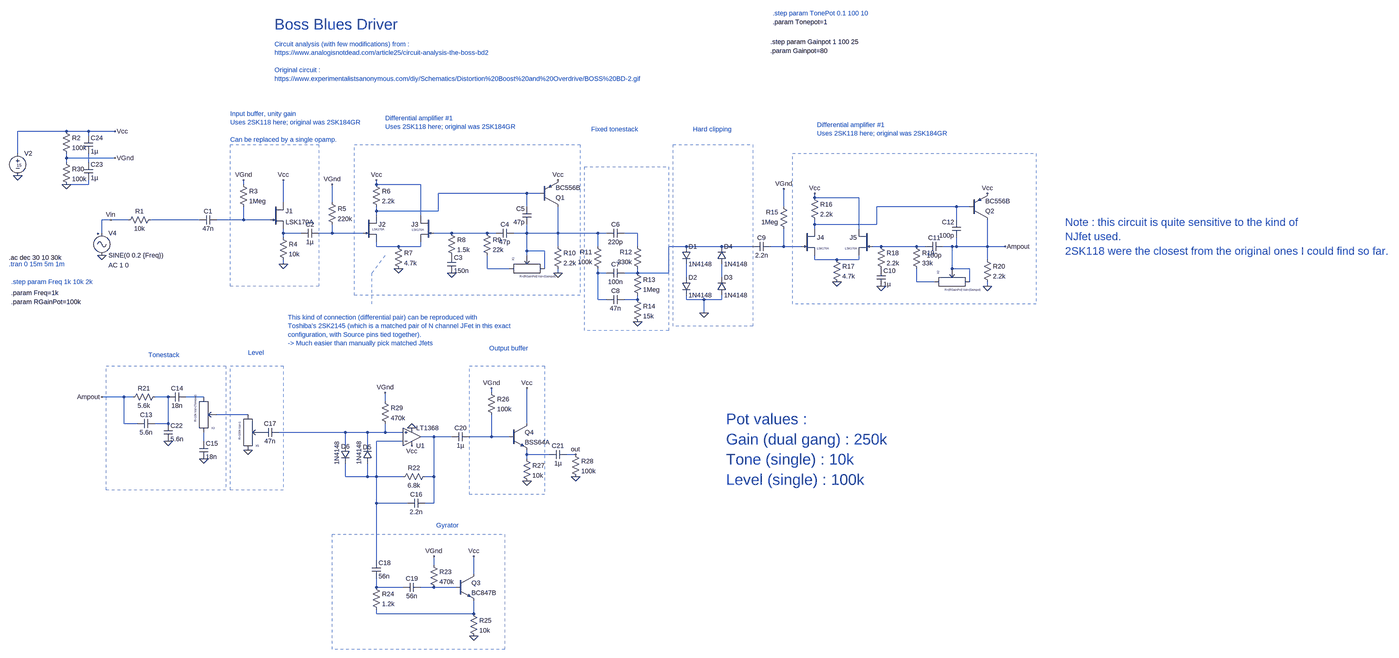
[diagram p0: schematic BossBluesDriver_Tweaked.asc, whole sheet]
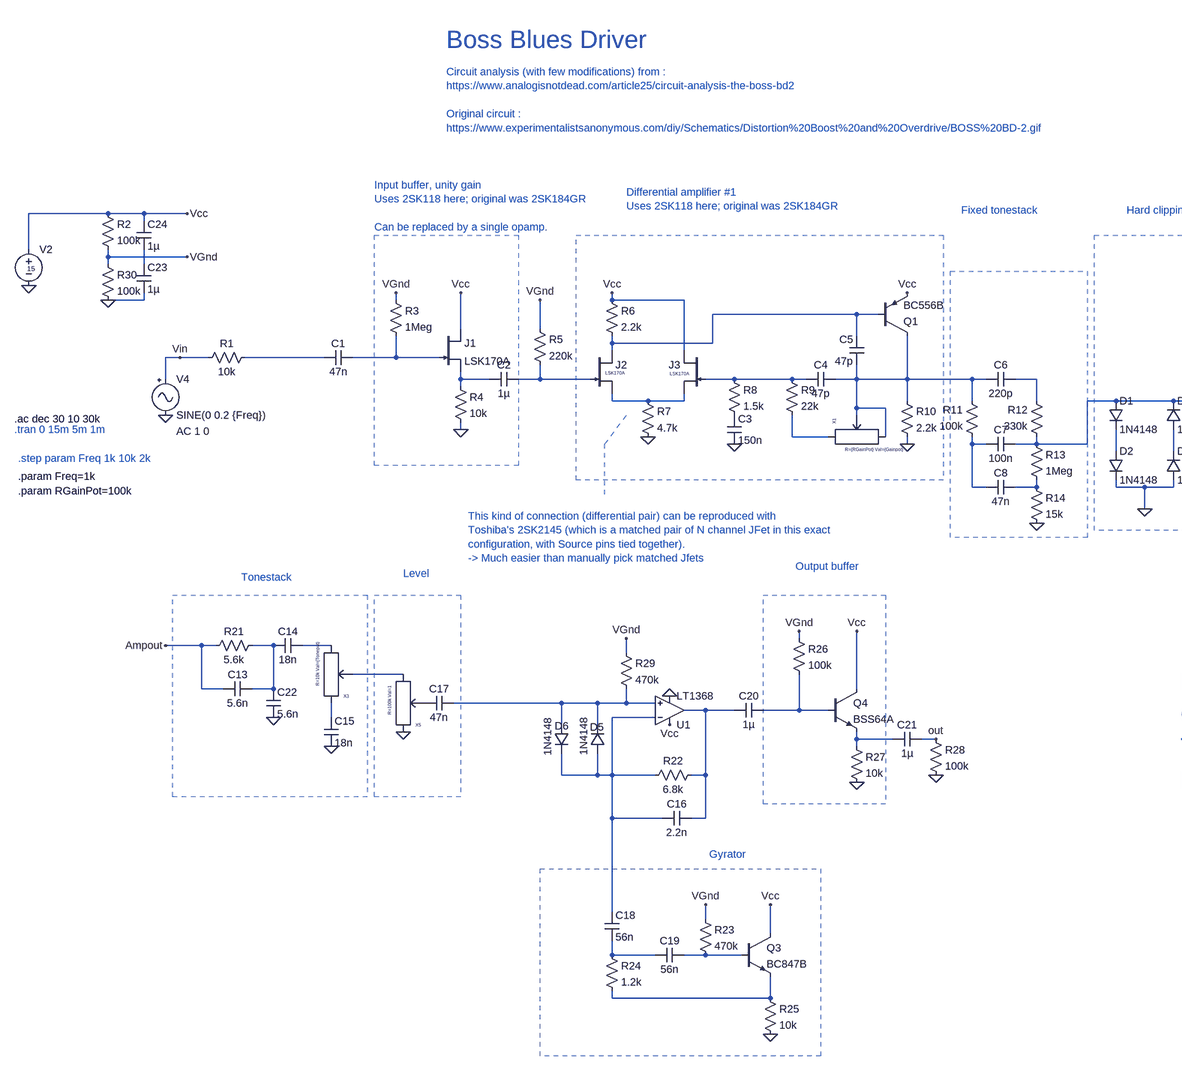
[diagram p1: schematic BossBluesDriver_Tweaked.asc, part, row 1 of 1, column 1 of 2]
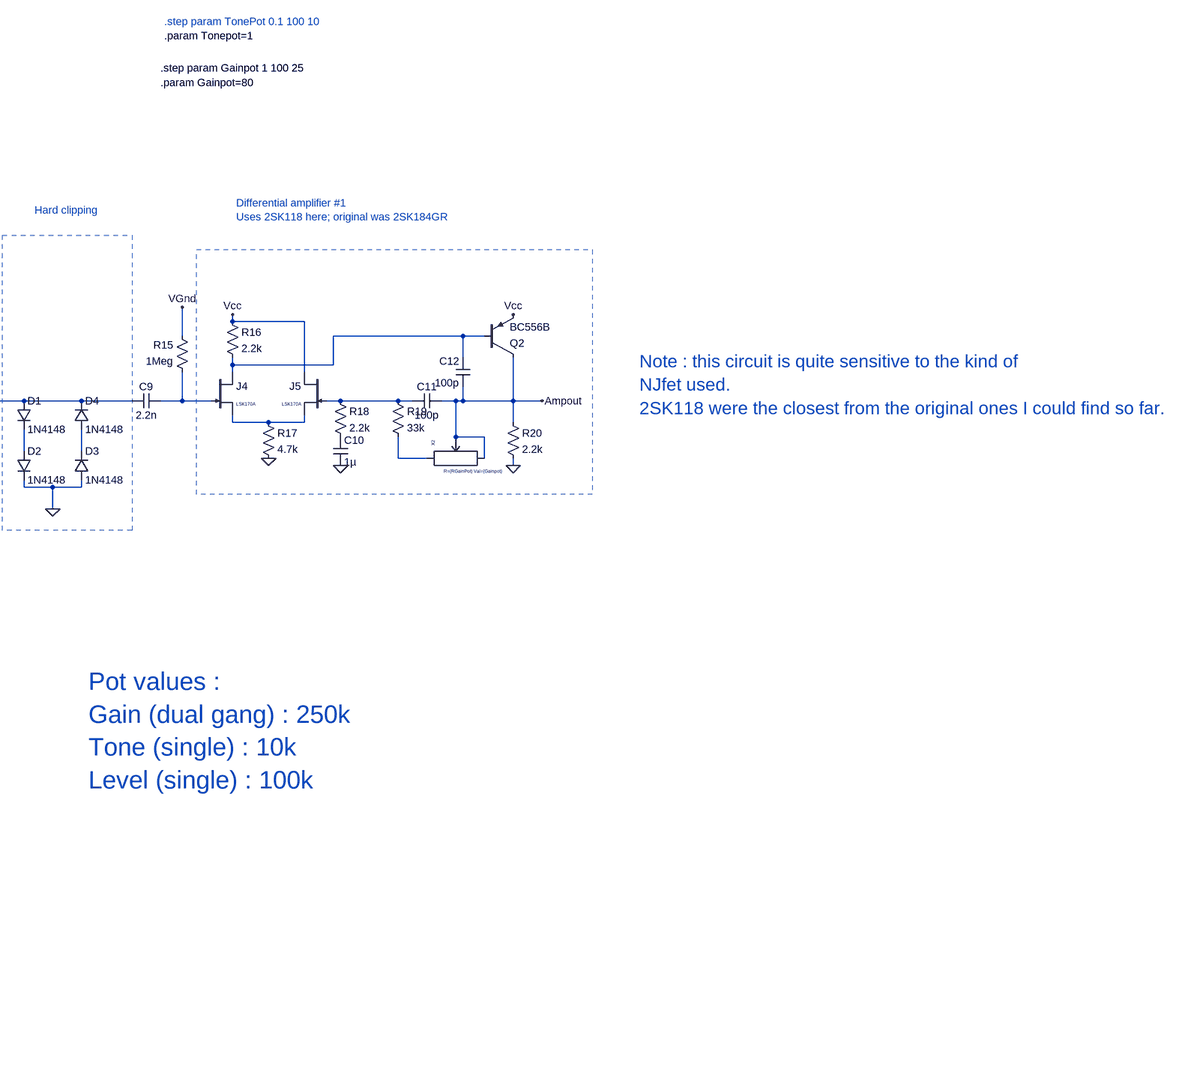
[diagram p2: schematic BossBluesDriver_Tweaked.asc, part, row 1 of 1, column 2 of 2]
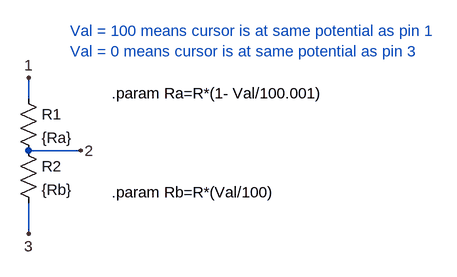
[diagram p3: sub-circuit potentiometer.asc]
BossBluesDriver_Tweaked.asc, the LTspice schematic file:
Version 4
SHEET 1 4768 1732
WIRE -384 -144 -560 -144
WIRE -304 -144 -384 -144
WIRE -208 -144 -304 -144
WIRE -304 -128 -304 -144
WIRE -560 -64 -560 -144
WIRE -384 -48 -384 -64
WIRE -208 -48 -384 -48
WIRE -384 -32 -384 -48
WIRE -304 -32 -304 -64
WIRE -304 48 -304 32
WIRE -304 48 -384 48
WIRE 256 48 256 32
WIRE 736 48 736 32
WIRE 896 48 736 48
WIRE 1280 80 960 80
WIRE 1328 80 1280 80
WIRE 2320 96 2320 80
WIRE 2480 96 2320 96
WIRE 400 112 400 32
WIRE 576 112 576 48
WIRE 1280 128 1280 80
WIRE 2208 128 2208 64
WIRE 2832 128 2544 128
WIRE 2880 128 2832 128
WIRE 736 144 736 128
WIRE 960 144 960 80
WIRE 960 144 736 144
WIRE 736 160 736 144
WIRE 896 160 896 48
WIRE -224 176 -256 176
WIRE -160 176 -224 176
WIRE 96 176 -80 176
WIRE 256 176 256 128
WIRE 256 176 160 176
WIRE 352 176 256 176
WIRE 2832 176 2832 128
WIRE 2320 192 2320 176
WIRE 2544 192 2544 128
WIRE 2544 192 2320 192
WIRE 2320 208 2320 192
WIRE 2480 208 2480 96
WIRE -256 224 -256 176
WIRE 400 224 400 208
WIRE 464 224 400 224
WIRE 576 224 576 192
WIRE 576 224 528 224
WIRE 688 224 576 224
WIRE 1008 224 944 224
WIRE 1136 224 1008 224
WIRE 1168 224 1136 224
WIRE 1280 224 1280 192
WIRE 1280 224 1232 224
WIRE 1392 224 1392 128
WIRE 1392 224 1280 224
WIRE 1536 224 1392 224
WIRE 1568 224 1536 224
WIRE 1680 224 1632 224
WIRE 400 240 400 224
WIRE 736 272 736 256
WIRE 816 272 736 272
WIRE 896 272 896 256
WIRE 896 272 816 272
WIRE 1392 272 1392 224
WIRE 1536 272 1536 224
WIRE 1680 272 1680 224
WIRE 1856 272 1792 272
WIRE 1984 272 1856 272
WIRE 2096 272 1984 272
WIRE 2208 272 2208 208
WIRE 2208 272 2160 272
WIRE 2272 272 2208 272
WIRE 2560 272 2528 272
WIRE 2688 272 2560 272
WIRE 2720 272 2688 272
WIRE 2816 272 2784 272
WIRE 2832 272 2832 240
WIRE 2832 272 2816 272
WIRE 2944 272 2944 176
WIRE 2944 272 2832 272
WIRE 3008 272 2944 272
WIRE 1280 288 1280 224
WIRE 1344 288 1280 288
WIRE 1280 304 1280 288
WIRE 2320 320 2320 304
WIRE 2400 320 2320 320
WIRE 2480 320 2480 304
WIRE 2480 320 2400 320
WIRE 2944 320 2944 272
WIRE 400 336 400 320
WIRE 1136 352 1136 304
WIRE 1216 352 1136 352
WIRE 1344 352 1344 288
WIRE 2816 352 2816 272
WIRE 2880 352 2816 352
WIRE 1392 368 1392 352
WIRE 1536 368 1536 352
WIRE 1568 368 1536 368
WIRE 1680 368 1680 352
WIRE 1680 368 1632 368
WIRE 1792 368 1792 272
WIRE 1792 368 1680 368
WIRE 1856 384 1856 336
WIRE 1984 384 1984 336
WIRE 2688 400 2688 352
WIRE 2752 400 2688 400
WIRE 2880 400 2880 352
WIRE 2944 416 2944 400
WIRE 1536 464 1536 368
WIRE 1568 464 1536 464
WIRE 1680 464 1680 448
WIRE 1680 464 1632 464
WIRE 1856 464 1856 448
WIRE 1920 464 1856 464
WIRE 1984 464 1984 448
WIRE 1984 464 1920 464
WIRE 1920 512 1920 464
WIRE 1152 800 1152 784
WIRE -176 816 -256 816
WIRE -144 816 -176 816
WIRE -16 816 -64 816
WIRE 112 816 48 816
WIRE 768 832 768 800
WIRE 272 880 160 880
WIRE -176 912 -176 816
WIRE -128 912 -176 912
WIRE -16 912 -16 816
WIRE -16 912 -64 912
WIRE 1280 912 1280 784
WIRE 624 944 384 944
WIRE 704 944 624 944
WIRE 768 944 768 912
WIRE 768 944 704 944
WIRE 832 944 768 944
WIRE 944 960 896 960
WIRE 1008 960 944 960
WIRE 1152 960 1152 880
WIRE 1152 960 1072 960
WIRE 1216 960 1152 960
WIRE 112 976 112 944
WIRE 832 976 736 976
WIRE 624 992 624 944
WIRE 704 992 704 944
WIRE 1280 1024 1280 1008
WIRE 1360 1024 1280 1024
WIRE 1456 1024 1424 1024
WIRE 1280 1040 1280 1024
WIRE 624 1104 624 1056
WIRE 704 1104 704 1056
WIRE 704 1104 624 1104
WIRE 736 1104 736 976
WIRE 736 1104 704 1104
WIRE 832 1104 736 1104
WIRE 944 1104 944 960
WIRE 944 1104 912 1104
WIRE 736 1200 736 1104
WIRE 848 1200 736 1200
WIRE 944 1200 944 1104
WIRE 944 1200 912 1200
WIRE 736 1408 736 1200
WIRE 944 1424 944 1392
WIRE 1088 1456 1088 1392
WIRE 736 1504 736 1472
WIRE 832 1504 736 1504
WIRE 944 1504 896 1504
WIRE 1024 1504 944 1504
WIRE 736 1600 736 1584
WIRE 1088 1600 1088 1552
WIRE 1088 1600 736 1600
FLAG -560 16 0
FLAG -208 -48 VGnd
FLAG -208 -144 Vcc
FLAG -256 304 0
FLAG -224 176 Vin
FLAG 400 336 0
FLAG 816 352 0
FLAG 1008 368 0
FLAG 1392 368 0
FLAG 1680 544 0
FLAG 1920 512 0
FLAG 2400 400 0
FLAG 2560 416 0
FLAG 2944 416 0
FLAG 3008 272 Ampout
FLAG -256 816 Ampout
FLAG 112 1040 0
FLAG 272 1008 0
FLAG 1088 1680 0
FLAG 864 928 0
FLAG 864 992 Vcc
FLAG 1280 1120 0
FLAG 1280 784 Vcc
FLAG 1456 1104 0
FLAG -16 976 0
FLAG 1456 1024 out
FLAG -384 48 0
FLAG 256 32 VGnd
FLAG 576 48 VGnd
FLAG 400 32 Vcc
FLAG 736 32 Vcc
FLAG 1392 32 Vcc
FLAG 2208 64 VGnd
FLAG 2320 80 Vcc
FLAG 2944 80 Vcc
FLAG 768 800 VGnd
FLAG 1152 784 VGnd
FLAG 944 1392 VGnd
FLAG 1088 1392 Vcc
SYMBOL voltage -560 -80 R0
WINDOW 123 0 0 Left 0
WINDOW 39 0 0 Left 0
WINDOW 3 -4 58 Left 1
SYMATTR Value 15
SYMATTR InstName V2
SYMBOL Misc\\signal -256 208 R0
WINDOW 123 24 132 Left 2
WINDOW 39 0 0 Left 0
SYMATTR Value2 AC 1 0
SYMATTR InstName V4
SYMATTR Value SINE(0 0.2 {Freq})
SYMBOL cap 160 160 R90
WINDOW 0 0 32 VBottom 2
WINDOW 3 32 32 VTop 2
SYMATTR InstName C1
SYMATTR Value 47n
SYMBOL res 240 32 R0
SYMATTR InstName R3
SYMATTR Value 1Meg
SYMBOL res 384 224 R0
SYMATTR InstName R4
SYMATTR Value 10k
SYMBOL cap 528 208 R90
WINDOW 0 0 32 VBottom 2
WINDOW 3 32 32 VTop 2
SYMATTR InstName C2
SYMATTR Value 1µ
SYMBOL res 560 96 R0
SYMATTR InstName R5
SYMATTR Value 220k
SYMBOL njf 688 160 R0
WINDOW 3 33 51 Left 0
SYMATTR Value LSK170A
SYMATTR InstName J2
SYMBOL res 720 32 R0
SYMATTR InstName R6
SYMATTR Value 2.2k
SYMBOL res 800 256 R0
SYMATTR InstName R7
SYMATTR Value 4.7k
SYMBOL njf 944 160 M0
WINDOW 3 37 52 Left 0
SYMATTR Value LSK170A
SYMATTR InstName J3
SYMBOL res 992 208 R0
SYMATTR InstName R8
SYMATTR Value 1.5k
SYMBOL cap 992 304 R0
SYMATTR InstName C3
SYMATTR Value 150n
SYMBOL res 1120 208 R0
SYMATTR InstName R9
SYMATTR Value 22k
SYMBOL Potentiometer 1280 352 R270
WINDOW 39 -29 -26 VRight 0
SYMATTR SpiceLine R={RGainPot} Val={Gainpot}
SYMATTR InstName X1
SYMBOL cap 1232 208 R90
WINDOW 0 0 32 VBottom 2
WINDOW 3 32 32 VTop 2
SYMATTR InstName C4
SYMATTR Value 47p
SYMBOL cap 1296 192 R180
WINDOW 0 24 56 Left 2
WINDOW 3 24 8 Left 2
SYMATTR InstName C5
SYMATTR Value 47p
SYMBOL pnp 1328 128 M180
SYMATTR InstName Q1
SYMATTR Value BC556B
SYMBOL res 1376 256 R0
SYMATTR InstName R10
SYMATTR Value 2.2k
SYMBOL cap 1632 208 R90
WINDOW 0 0 32 VBottom 2
WINDOW 3 32 32 VTop 2
SYMATTR InstName C6
SYMATTR Value 220p
SYMBOL res 1552 368 R180
WINDOW 0 36 76 Left 2
WINDOW 3 36 40 Left 2
SYMATTR InstName R11
SYMATTR Value 100k
SYMBOL res 1696 368 R180
WINDOW 0 36 76 Left 2
WINDOW 3 36 40 Left 2
SYMATTR InstName R12
SYMATTR Value 330k
SYMBOL cap 1632 352 R90
WINDOW 0 0 32 VBottom 2
WINDOW 3 32 32 VTop 2
SYMATTR InstName C7
SYMATTR Value 100n
SYMBOL cap 1632 448 R90
WINDOW 0 0 32 VBottom 2
WINDOW 3 32 32 VTop 2
SYMATTR InstName C8
SYMATTR Value 47n
SYMBOL res 1664 352 R0
SYMATTR InstName R13
SYMATTR Value 1Meg
SYMBOL res 1664 448 R0
SYMATTR InstName R14
SYMATTR Value 15k
SYMBOL diode 1840 272 R0
SYMATTR InstName D1
SYMATTR Value 1N4148
SYMBOL diode 1840 384 R0
SYMATTR InstName D2
SYMATTR Value 1N4148
SYMBOL diode 1968 448 M180
WINDOW 0 24 64 Left 2
WINDOW 3 24 0 Left 2
SYMATTR InstName D3
SYMATTR Value 1N4148
SYMBOL diode 1968 336 M180
WINDOW 0 24 64 Left 2
WINDOW 3 24 0 Left 2
SYMATTR InstName D4
SYMATTR Value 1N4148
SYMBOL cap 2160 256 R90
WINDOW 0 0 32 VBottom 2
WINDOW 3 32 32 VTop 2
SYMATTR InstName C9
SYMATTR Value 2.2n
SYMBOL res 2224 224 R180
WINDOW 0 36 76 Left 2
WINDOW 3 36 40 Left 2
SYMATTR InstName R15
SYMATTR Value 1Meg
SYMBOL njf 2272 208 R0
WINDOW 3 56 72 Left 0
SYMATTR Value LSK170A
SYMATTR InstName J4
SYMBOL res 2304 80 R0
SYMATTR InstName R16
SYMATTR Value 2.2k
SYMBOL res 2384 304 R0
SYMATTR InstName R17
SYMATTR Value 4.7k
SYMBOL njf 2528 208 M0
WINDOW 3 56 72 Left 0
SYMATTR Value LSK170A
SYMATTR InstName J5
SYMBOL res 2544 256 R0
SYMATTR InstName R18
SYMATTR Value 2.2k
SYMBOL cap 2544 352 R0
SYMATTR InstName C10
SYMATTR Value 1µ
SYMBOL res 2672 256 R0
SYMATTR InstName R19
SYMATTR Value 33k
SYMBOL Potentiometer 2816 400 R270
WINDOW 39 -29 -26 VRight 0
SYMATTR SpiceLine R={RGainPot} Val={Gainpot}
SYMATTR InstName X2
SYMBOL cap 2784 256 R90
WINDOW 0 0 32 VBottom 2
WINDOW 3 32 32 VTop 2
SYMATTR InstName C11
SYMATTR Value 100p
SYMBOL cap 2848 240 R180
WINDOW 0 24 56 Left 2
WINDOW 3 24 8 Left 2
SYMATTR InstName C12
SYMATTR Value 100p
SYMBOL pnp 2880 176 M180
SYMATTR InstName Q2
SYMATTR Value BC556B
SYMBOL res 2928 304 R0
SYMATTR InstName R20
SYMATTR Value 2.2k
SYMBOL res -48 800 R90
WINDOW 0 0 56 VBottom 2
WINDOW 3 32 56 VTop 2
SYMATTR InstName R21
SYMATTR Value 5.6k
SYMBOL cap -64 896 R90
WINDOW 0 0 32 VBottom 2
WINDOW 3 32 32 VTop 2
SYMATTR InstName C13
SYMATTR Value 5.6n
SYMBOL cap 48 800 R90
WINDOW 0 0 32 VBottom 2
WINDOW 3 32 32 VTop 2
SYMATTR InstName C14
SYMATTR Value 18n
SYMBOL Potentiometer 112 880 M180
WINDOW 39 -29 -26 VRight 0
SYMATTR SpiceLine R=10k Val={Tonepot}
SYMATTR InstName X3
SYMBOL cap 96 976 R0
SYMATTR InstName C15
SYMATTR Value 18n
SYMBOL Potentiometer 272 944 M180
WINDOW 39 -29 -26 VRight 0
SYMATTR SpiceLine R=100k Val=1
SYMATTR InstName X5
SYMBOL cap 384 928 R90
WINDOW 0 0 32 VBottom 2
WINDOW 3 32 32 VTop 2
SYMATTR InstName C17
SYMATTR Value 47n
SYMBOL diode 720 1056 R180
WINDOW 0 2 59 Left 2
WINDOW 3 126 -5 VRight 2
SYMATTR InstName D5
SYMATTR Value 1N4148
SYMBOL diode 608 992 R0
WINDOW 0 1 3 Left 2
WINDOW 3 66 68 VLeft 2
SYMATTR InstName D6
SYMATTR Value 1N4148
SYMBOL res 928 1088 R90
WINDOW 0 0 56 VBottom 2
WINDOW 3 32 56 VTop 2
SYMATTR InstName R22
SYMATTR Value 6.8k
SYMBOL cap 912 1184 R90
WINDOW 0 0 32 VBottom 2
WINDOW 3 32 32 VTop 2
SYMATTR InstName C16
SYMATTR Value 2.2n
SYMBOL cap 720 1408 R0
SYMATTR InstName C18
SYMATTR Value 56n
SYMBOL cap 896 1488 R90
WINDOW 0 0 32 VBottom 2
WINDOW 3 32 32 VTop 2
SYMATTR InstName C19
SYMATTR Value 56n
SYMBOL res 928 1408 R0
SYMATTR InstName R23
SYMATTR Value 470k
SYMBOL npn 1024 1456 R0
SYMATTR InstName Q3
SYMATTR Value BC847B
SYMBOL res 720 1488 R0
SYMATTR InstName R24
SYMATTR Value 1.2k
SYMBOL res 1072 1584 R0
SYMATTR InstName R25
SYMATTR Value 10k
SYMBOL cap 1072 944 R90
WINDOW 0 0 32 VBottom 2
WINDOW 3 32 32 VTop 2
SYMATTR InstName C20
SYMATTR Value 1µ
SYMBOL res 1136 784 R0
SYMATTR InstName R26
SYMATTR Value 100k
SYMBOL npn 1216 912 R0
SYMATTR InstName Q4
SYMATTR Value BSS64A
SYMBOL res 1264 1024 R0
SYMATTR InstName R27
SYMATTR Value 10k
SYMBOL cap 1424 1008 R90
WINDOW 0 0 32 VBottom 2
WINDOW 3 32 32 VTop 2
SYMATTR InstName C21
SYMATTR Value 1µ
SYMBOL res 1440 1008 R0
SYMATTR InstName R28
SYMATTR Value 100k
SYMBOL res 752 816 R0
SYMATTR InstName R29
SYMATTR Value 470k
SYMBOL cap -32 912 R0
SYMATTR InstName C22
SYMATTR Value 5.6n
SYMBOL res -64 160 R90
WINDOW 0 0 56 VBottom 2
WINDOW 3 32 56 VTop 2
SYMATTR InstName R1
SYMATTR Value 10k
SYMBOL njf 352 112 R0
SYMATTR InstName J1
SYMATTR Value LSK170A
SYMBOL OpAmps\\LT1368 864 1024 M180
SYMATTR InstName U1
SYMBOL res -400 -160 R0
SYMATTR InstName R2
SYMATTR Value 100k
SYMBOL res -400 -48 R0
SYMATTR InstName R30
SYMATTR Value 100k
SYMBOL cap -320 -32 R0
SYMATTR InstName C23
SYMATTR Value 1µ
SYMBOL cap -320 -128 R0
SYMATTR InstName C24
SYMATTR Value 1µ
TEXT -592 336 Left 2 ;.tran 0 15m 5m 1m
TEXT 2160 -544 Left 2 !.step param Gainpot 1 100 25
TEXT 2160 -512 Left 2 !.param Gainpot=80
TEXT -584 400 Left 2 ;.step param Freq 1k 10k 2k
TEXT -584 440 Left 2 !.param Freq=1k
TEXT 368 -608 Left 5 ;Boss Blues Driver
TEXT -592 312 Left 2 !.ac dec 30 10 30k
TEXT 2168 -648 Left 2 ;.step param TonePot 0.1 100 10
TEXT 2168 -616 Left 2 !.param Tonepot=1
TEXT 368 -536 Left 2 ;Circuit analysis (with few modifications) from :\nhttps://www.analogisnotdead.com/article25/circuit-analysis-the-boss-bd2 \n \nOriginal circuit :\nhttps://www.experimentalistsanonymous.com/diy/Schematics/Distortion%20Boost%20and%20Overdrive/BOSS%20BD-2.gif
TEXT 768 -192 Left 2 ;Differential amplifier #1\nUses 2SK118 here; original was 2SK184GR
TEXT 208 -208 Left 2 ;Input buffer, unity gain\nUses 2SK118 here; original was 2SK184GR\n \nCan be replaced by a single opamp.
TEXT 2328 -168 Left 2 ;Differential amplifier #1\nUses 2SK118 here; original was 2SK184GR
TEXT 1880 -152 Left 2 ;Hard clipping
TEXT 1512 -152 Left 2 ;Fixed tonestack
TEXT -88 664 Left 2 ;Tonestack
TEXT 272 656 Left 2 ;Level
TEXT 952 1280 Left 2 ;Gyrator
TEXT 1144 640 Left 2 ;Output buffer
TEXT 3328 184 Left 4 ;Note : this circuit is quite sensitive to the kind of \nNJfet used. \n2SK118 were the closest from the original ones I could find so far.
TEXT 2000 896 Left 5 ;Pot values : \nGain (dual gang) : 250k\nTone (single) : 10k\nLevel (single) : 100k
TEXT 416 528 Left 2 ;This kind of connection (differential pair) can be reproduced with \nToshiba's 2SK2145 (which is a matched pair of N channel JFet in this exact\nconfiguration, with Source pins tied together).\n-> Much easier than manually pick matched Jfets
TEXT -584 472 Left 2 !.param RGainPot=100k
LINE Normal 720 368 768 304 2
LINE Normal 720 480 720 368 2
LINE Normal 912 528 912 528 2
RECTANGLE Normal 528 416 208 -96 2
RECTANGLE Normal 1472 448 656 -96 2
RECTANGLE Normal 1792 576 1488 -16 2
RECTANGLE Normal 3120 480 2240 -64 2
RECTANGLE Normal 2096 560 1808 -96 2
RECTANGLE Normal 192 1152 -240 704 2
RECTANGLE Normal 400 1152 208 704 2
RECTANGLE Normal 1200 1728 576 1312 2
RECTANGLE Normal 1344 1168 1072 704 2

potentiometer.asc, the sub-circuit schematic file:
Version 4
SHEET 1 908 680
WIRE 192 96 192 64
WIRE 272 176 192 176
WIRE 192 304 192 256
FLAG 192 64 1
FLAG 272 176 2
FLAG 192 304 3
SYMBOL res 176 80 R0
SYMATTR InstName R1
SYMATTR Value {Ra}
SYMBOL res 176 160 R0
SYMATTR InstName R2
SYMATTR Value {Rb}
TEXT 320 88 Left 2 !.param Ra=R*(1- Val/100.001)
TEXT 320 240 Left 2 !.param Rb=R*(Val/100)
TEXT 256 -8 Left 2 ;Val = 100 means cursor is at same potential as pin 1\nVal = 0 means cursor is at same potential as pin 3

The netlist it stands for:
* BossBluesDriver_Tweaked.asc
V2 Vcc 0 15
V4 Vin 0 SINE(0 0.2 {Freq}) AC 1 0
C1 N005 N004 47n
R3 VGnd N005 1Meg
R4 N006 0 10k
C2 N007 N006 1µ
R5 VGnd N007 220k
J2 N002 N007 N011 LSK170A
R6 Vcc N002 2.2k
R7 N011 0 4.7k
J3 Vcc N008 N011 LSK170A
R8 N008 P001 1.5k
C3 P001 0 150n
R9 N008 N016 22k
XX1 N016 N009 N009 potentiometer params: R={RGainPot} Val={Gainpot}
C4 N009 N008 47p
C5 N009 N002 47p
Q1 N009 N002 Vcc 0 BC556B
R10 N009 0 2.2k
C6 N010 N009 220p
R11 N017 N009 100k
R12 N012 N010 330k
C7 N012 N017 100n
C8 N021 N017 47n
R13 N012 N021 1Meg
R14 N021 0 15k
D1 N012 N018 1N4148
D2 N018 0 1N4148
D3 0 N019 1N4148
D4 N019 N012 1N4148
C9 N013 N012 2.2n
R15 N013 VGnd 1Meg
J4 N003 N013 N015 LSK170A
R16 Vcc N003 2.2k
R17 N015 0 4.7k
J5 Vcc N014 N015 LSK170A
R18 N014 P002 2.2k
C10 P002 0 1µ
R19 N014 N020 33k
XX2 N020 Ampout Ampout potentiometer params: R={RGainPot} Val={Gainpot}
C11 Ampout N014 100p
C12 Ampout N003 100p
Q2 Ampout N003 Vcc 0 BC556B
R20 Ampout 0 2.2k
R21 N022 Ampout 5.6k
C13 N022 Ampout 5.6n
C14 N023 N022 18n
XX3 N028 N024 N023 potentiometer params: R=10k Val={Tonepot}
C15 N028 0 18n
XX5 0 P003 N024 potentiometer params: R=100k Val=1
C17 N025 P003 47n
D5 N029 N025 1N4148
D6 N025 N029 1N4148
R22 N026 N029 6.8k
C16 N026 N029 2.2n
C18 N029 N031 56n
C19 N032 N031 56n
R23 VGnd N032 470k
Q3 Vcc N032 N033 0 BC847B
R24 N031 N033 1.2k
R25 N033 0 10k
C20 N027 N026 1µ
R26 VGnd N027 100k
Q4 Vcc N027 N030 0 BSS64A
R27 N030 0 10k
C21 out N030 1µ
R28 out 0 100k
R29 VGnd N025 470k
C22 N022 0 5.6n
R1 N004 Vin 10k
J1 Vcc N005 N006 LSK170A
XU1 N025 N029 Vcc 0 N026 LT1368  ; pins In+ In- V+ V- OUT
R2 Vcc VGnd 100k
R30 VGnd 0 100k
C23 N001 0 1µ
C24 Vcc N001 1µ

* block symbol definitions
.subckt potentiometer 1 2 3
R1 1 2 {Ra}
R2 2 3 {Rb}
.param Ra=R*(1- Val/100.001)
.param Rb=R*(Val/100)
* Val = 100 means cursor is at same potential as pin 1
* Val = 0 means cursor is at same potential as pin 3
.ends potentiometer

.model D D
.lib standard.dio
.model NPN NPN
.model PNP PNP
.lib standard.bjt
.model NJF NJF
.model PJF PJF
.lib standard.jft
* .tran 0 15m 5m 1m
.step param Gainpot 1 100 25
.param Gainpot=80
* .step param Freq 1k 10k 2k
.param Freq=1k
* Boss Blues Driver
.ac dec 30 10 30k
* .step param TonePot 0.1 100 10
.param Tonepot=1
* Circuit analysis (with few modifications) from :
* https://www.analogisnotdead.com/article25/circuit-analysis-the-boss-bd2
* Original circuit :
* https://www.experimentalistsanonymous.com/diy/Schematics/Distortion%20Boost%20and%20Overdrive/BOSS%20BD-2.gif
* Differential amplifier #1
* Uses 2SK118 here; original was 2SK184GR
* Input buffer, unity gain
* Uses 2SK118 here; original was 2SK184GR
* Can be replaced by a single opamp.
* Differential amplifier #1
* Uses 2SK118 here; original was 2SK184GR
* Hard clipping
* Fixed tonestack
* Tonestack
* Level
* Gyrator
* Output buffer
* Note : this circuit is quite sensitive to the kind of
* NJfet used.
* 2SK118 were the closest from the original ones I could find so far.
* Pot values :
* Gain (dual gang) : 250k
* Tone (single) : 10k
* Level (single) : 100k
* This kind of connection (differential pair) can be reproduced with
* Toshiba's 2SK2145 (which is a matched pair of N channel JFet in this exact
* configuration, with Source pins tied together).
* -> Much easier than manually pick matched Jfets
.param RGainPot=100k
.backanno
.end